# Altium schematic sheet P05_Ethernet.SchDoc
size A4
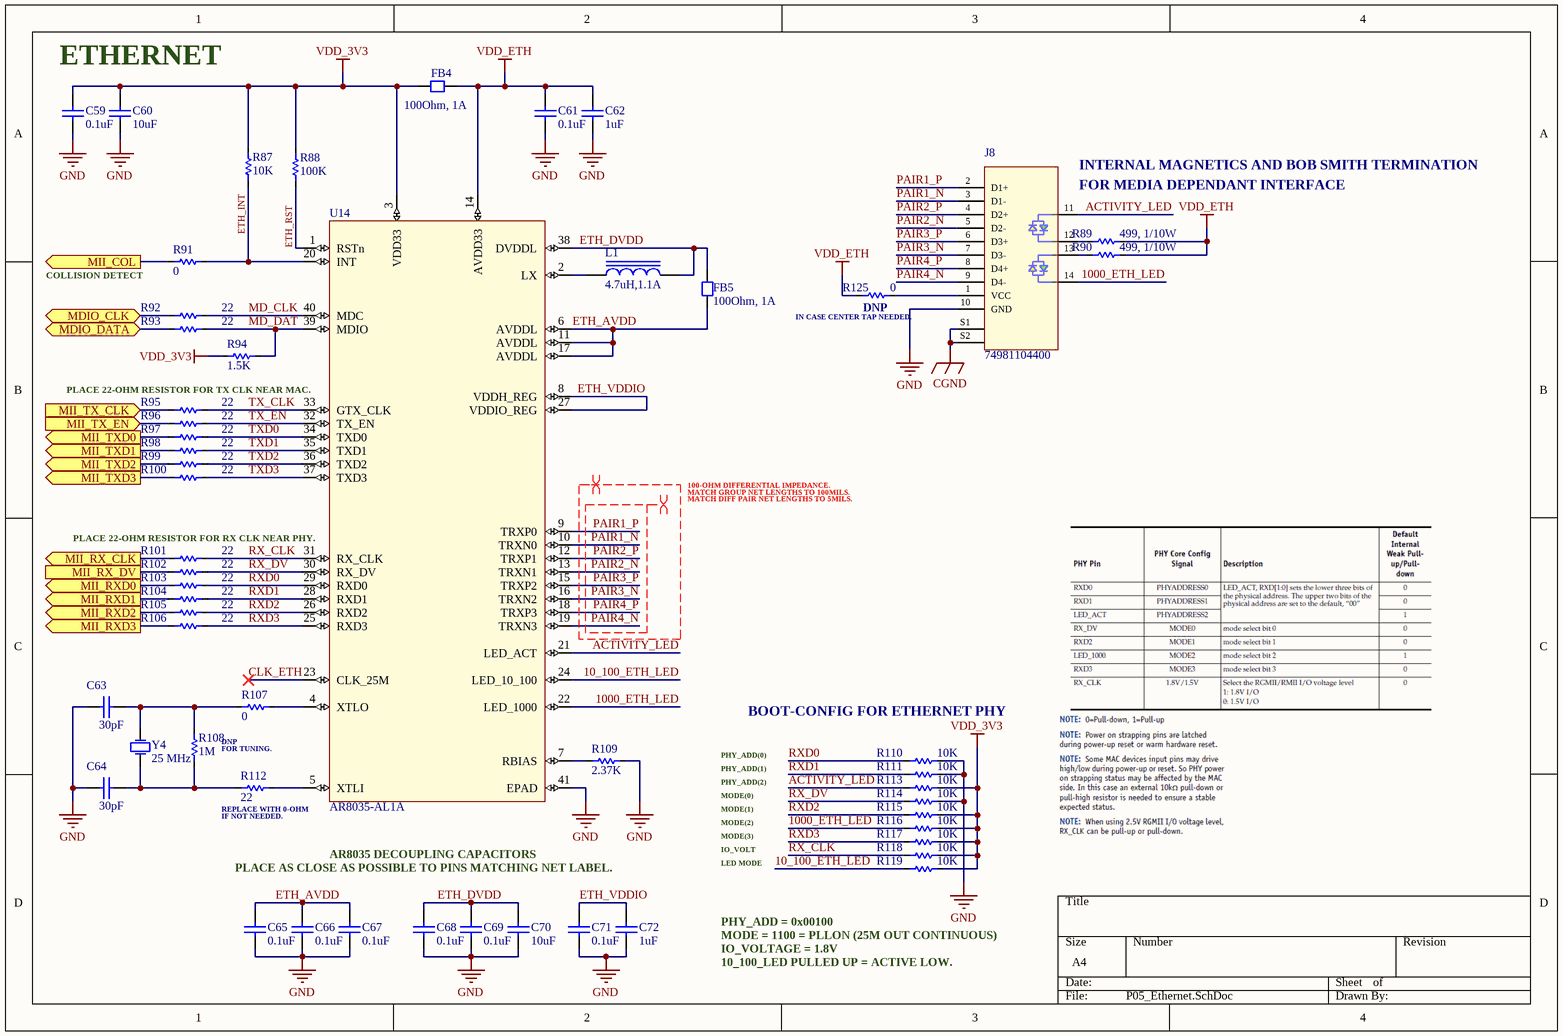
[diagram p0: P05_Ethernet.SchDoc]

## Parts
C59  0.1uF  [CAP_0603]
C60  10uF  [CAP_0603]
C61  0.1uF  [CAP_0603]
C62  1uF  [CAP_0603]
C63  30pF  [CAP_0603]
C64  30pF  [CAP_0603]
C65  0.1uF  [CAP_0603]
C66  0.1uF  [CAP_0603]
C67  0.1uF  [CAP_0603]
C68  0.1uF  [CAP_0603]
C69  0.1uF  [CAP_0603]
C70  10uF  [CAP_0603]
C71  0.1uF  [CAP_0603]
C72  1uF  [CAP_0603]
FB4  100Ohm, 1A  [CAP_0603]
FB5  100Ohm, 1A  [CAP_0603]
J8  74981104400  [74981104400]
L1  4.7uH,1.1A  [IND_1008]
R87  10K  [RES_0603]
R88  100K  [RES_0603]
R89  499, 1/10W  [RES_0603]
R90  499, 1/10W  [RES_0603]
R91  0  [RES_0603]
R92  22  [RES_0603]
R93  22  [RES_0603]
R94  1.5K  [RES_0603]
R95  22  [RES_0603]
R96  22  [RES_0603]
R97  22  [RES_0603]
R98  22  [RES_0603]
R99  22  [RES_0603]
R100  22  [RES_0603]
R101  22  [RES_0603]
R102  22  [RES_0603]
R103  22  [RES_0603]
R104  22  [RES_0603]
R105  22  [RES_0603]
R106  22  [RES_0603]
R107  0  [RES_0603]
R108  1M  [RES_0603]
R109  2.37K  [RES_0603]
R110  10K  [RES_0603]
R111  10K  [RES_0603]
R112  22  [RES_0603]
R113  10K  [RES_0603]
R114  10K  [RES_0603]
R115  10K  [RES_0603]
R116  10K  [RES_0603]
R117  10K  [RES_0603]
R118  10K  [RES_0603]
R119  10K  [RES_0603]
R125  0  [RES_0603]
U14  AR8035-AL1A  [QFN-40_5X5MM]
Y4  25 MHz  [7A-24MHz]

## Ports
MDIO_CLK (bidir), MDIO_DATA (bidir), MII_COL (out), MII_RX_CLK (out), MII_RX_DV, MII_RXD0 (out), MII_RXD1 (out), MII_RXD2 (out), MII_RXD3 (out), MII_TX_CLK (in), MII_TX_EN (in), MII_TXD0 (out), MII_TXD1 (out), MII_TXD2 (out), MII_TXD3 (out)

## Nets
CGND: J8.S1(Shield) J8.S2(Shield)
GND: C59.1 C60.1 C61.1 C62.1 C63.1(N) C64.1(N) C65.1 C66.1 C67.1 C68.1 C69.1 C70.1 C71.1 C72.1 J8.10(GND) R109.2 R110.2 R111.2 R114.2 U14.41(EPAD)
VDD_3V3: C59.2 C60.2 FB4.1 R87.2 R88.2 R94.2 R113.2 R115.2 R116.2 R117.2 R118.2 R119.2 U14.3(VDD33)
VDD_ETH: C61.2 C62.2 FB4.2 R89.2 R90.2 R125.1 U14.14(AVDD33)
10_100_ETH_LED: R119.1 U14.24(LED_10_100)
1000_ETH_LED: J8.14 R116.1 U14.22(LED_1000)
ACTIVITY_LED: J8.11 R113.1 U14.21(LED_ACT)
CLK_ETH: U14.23(CLK_25M)
ETH_AVDD: C65.2 C66.2 C67.2 FB5.1 U14.6(AVDDL) U14.11(AVDDL) U14.17(AVDDL)
ETH_DVDD: C68.2 C69.2 C70.2 FB5.2 L1.2 U14.38(DVDDL)
ETH_INT: R87.1 R91.2 U14.20(INT)
ETH_RST: R88.1 U14.1(RSTn)
ETH_VDDIO: C71.2 C72.2 U14.8(VDDH_REG) U14.27(VDDIO_REG)
MD_CLK: R92.2 U14.40(MDC)
MD_DAT: R93.2 R94.1 U14.39(MDIO)
MDIO_CLK: R92.1 ; port MDIO_CLK
MDIO_DATA: R93.1 ; port MDIO_DATA
MII_COL: R91.1 ; port MII_COL
MII_RX_CLK: R101.1 ; port MII_RX_CLK
MII_RX_DV: R102.1 ; port MII_RX_DV
MII_RXD0: R103.1 ; port MII_RXD0
MII_RXD1: R104.1 ; port MII_RXD1
MII_RXD2: R105.1 ; port MII_RXD2
MII_RXD3: R106.1 ; port MII_RXD3
MII_TX_CLK: R95.1 ; port MII_TX_CLK
MII_TX_EN: R96.1 ; port MII_TX_EN
MII_TXD0: R97.1 ; port MII_TXD0
MII_TXD1: R98.1 ; port MII_TXD1
MII_TXD2: R99.1 ; port MII_TXD2
MII_TXD3: R100.1 ; port MII_TXD3
PAIR1_N: J8.3(D1-) U14.10(TRXN0)
PAIR1_P: J8.2(D1+) U14.9(TRXP0)
PAIR2_N: J8.5(D2-) U14.13(TRXN1)
PAIR2_P: J8.4(D2+) U14.12(TRXP1)
PAIR3_N: J8.7(D3-) U14.16(TRXN2)
PAIR3_P: J8.6(D3+) U14.15(TRXP2)
PAIR4_N: J8.9(D4-) U14.19(TRXN3)
PAIR4_P: J8.8(D4+) U14.18(TRXP3)
RX_CLK: R101.2 R118.1 U14.31(RX_CLK)
RX_DV: R102.2 R114.1 U14.30(RX_DV)
RXD0: R103.2 R110.1 U14.29(RXD0)
RXD1: R104.2 R111.1 U14.28(RXD1)
RXD2: R105.2 R115.1 U14.26(RXD2)
RXD3: R106.2 R117.1 U14.25(RXD3)
TX_CLK: R95.2 U14.33(GTX_CLK)
TX_EN: R96.2 U14.32(TX_EN)
TXD0: R97.2 U14.34(TXD0)
TXD1: R98.2 U14.35(TXD1)
TXD2: R99.2 U14.36(TXD2)
TXD3: R100.2 U14.37(TXD3)
NetC63_2: C63.2(P) R107.1 R108.2 Y4.2(OSC2)
NetC64_2: C64.2(P) R108.1 R112.1 Y4.1(OSC1)
NetJ8_1: J8.1(VCC) R125.2
NetJ8_12: J8.12 R89.1
NetJ8_13: J8.13 R90.1
NetL1_1: L1.1 U14.2(LX)
NetR107_2: R107.2 U14.4(XTLO)
NetR109_1: R109.1 U14.7(RBIAS)
NetR112_2: R112.2 U14.5(XTLI)

## Layout directives
differential pair; differential pair class ETHERNET; rule Matched Net Lengths [Tolerance = 5mil]: PAIR1_N, PAIR1_P, PAIR2_N, PAIR2_P, PAIR3_N, PAIR3_P, PAIR4_N, PAIR4_P
differential pair; differential pair class Z100_DIFF_ETH; rule Matched Net Lengths [Tolerance = 100mil]: PAIR1_N, PAIR1_P, PAIR2_N, PAIR2_P, PAIR3_N, PAIR3_P, PAIR4_N, PAIR4_P

## Notes on the sheet
- ETHERNET
- (near J8) INTERNAL MAGNETICS AND BOB SMITH TERMINATION
- (near J8) FOR MEDIA DEPENDANT INTERFACE
- COLLISION DETECT
- (near R125) DNP
- (near R125) IN CASE CENTER TAP NEEDED.
- (near R95) PLACE 22-OHM RESISTOR FOR TX CLK NEAR MAC.
- 100-OHM DIFFERENTIAL IMPEDANCE.
- MATCH GROUP NET LENGTHS TO 100MILS.
- MATCH DIFF PAIR NET LENGTHS TO 5MILS.
- (near R101) PLACE 22-OHM RESISTOR FOR RX CLK NEAR PHY.
- BOOT-CONFIG FOR ETHERNET PHY
- DNP
- FOR TUNING.
- PHY_ADD(0)
- PHY_ADD(1)
- PHY_ADD(2)
- (near R112) REPLACE WITH 0-OHM
- (near R112) IF NOT NEEDED.
- MODE(0)
- MODE(1)
- MODE(2)
- MODE(3)
- IO_VOLT
- PLACE AS CLOSE AS POSSIBLE TO PINS MATCHING NET LABEL.
- AR8035 DECOUPLING CAPACITORS
- PHY_ADD = 0x00100
- LED MODE
- MODE = 1100 = PLLON (25M OUT CONTINUOUS)
- IO_VOLTAGE = 1.8V
- 10_100_LED PULLED UP = ACTIVE LOW.

## Library data of the parts
C59 C61 C65-C69 C71 = C0603C104M4RACTU: CAP CER 0.1UF 16V X7R 0603; Manufacturer: KEMET; Tolerance: 20%; ComponentLink1Description: Manufacturer; ComponentLink1URL: http://www.we-online.de; Value: 0.1uF; Rated Voltage: 16V; Ceramic Type: X7R; Supplier Part No.: 399-1099-1-ND; Package Reference: CAP_0603; Package Description: 0603; Mounting Technology: SMD; Manufacturer Part No.: C0603C104M4RACTU; Datasheet: https://content.kemet.com/datasheets/KEM_C1002_X7R_SMD.pdf; Supplier: Digi-Key; ComponentLink2Description: Datasheet; ComponentLink2URL: https://content.kemet.com/datasheets/KEM_C1002_X7R_SMD.pdf
C60 C70 = C0603C106M8PAC7867: CAP CER 10UF 10V X5R 0603; Manufacturer: KEMET; Ceramic Type: X7R; Tolerance: 20%; ComponentLink1Description: Manufacturer; ComponentLink1URL: http://www.we-online.de; Value: 10uF; Rated Voltage: 10V; Supplier Part No.: 399-14945-1-ND; Package Reference: CAP_0603; Package Description: 0603; Mounting Technology: SMD; Manufacturer Part No.: C0603C106M8PAC7867; Datasheet: https://content.kemet.com/datasheets/KEM_C1002_X7R_SMD.pdf; Supplier: Digi-Key; ComponentLink2Description: Datasheet; ComponentLink2URL: https://content.kemet.com/datasheets/KEM_C1002_X7R_SMD.pdf
C62 C72 = C0603C105M4RACTU: CAP CER 1UF 16V X7R 0603; Manufacturer: KEMET; Tolerance: 20%; ComponentLink1Description: Manufacturer; ComponentLink1URL: http://www.we-online.de; Value: 1uF; Rated Voltage: 16V; Ceramic Type: X7R; Supplier Part No.: 399-11136-1-ND; Package Reference: CAP_0603; Package Description: 0603; Mounting Technology: SMD; Manufacturer Part No.: C0603C105M4RACTU; Datasheet: https://content.kemet.com/datasheets/KEM_C1002_X7R_SMD.pdf; Supplier: Digi-Key; ComponentLink2Description: Datasheet; ComponentLink2URL: https://content.kemet.com/datasheets/KEM_C1002_X7R_SMD.pdf
C63 C64 = 06035A300JAT2A: CAP CER 30PF 50V C0G/NP0 0603; Manufacturer: AVX Corporation; Tolerance: 5%; Rated Voltage: 50 VDC; ComponentLink1Description: Manufacturer; ComponentLink1URL: http://www.we-online.de; ComponentLink2Description: Datasheet; ComponentLink2URL: https://katalog.we-online.com/pbs/datasheet/865080345012.pdf; Mounting Technology: SMD; Value: 30 pF; Manufacturer Part No.: 06035A300JAT2A; Datasheet: *; Supplier: Digi-Key; Package Reference: CAP_0603; Supplier Part No.: 478-7917-1-ND; Package Description: 0603
FB4 FB5 = MPZ1608D101BTA00: FERRITE BEAD 100 OHM 0603 1LN; Manufacturer: TDK Corporation; Datasheet: https://product.tdk.com/info/en/catalog/datasheets/beads_commercial_power_mpz1608_en.pdf; Manufacturer Part No.: MPZ1608D101BTA00; Supplier: Digi-Key; Package Description: 100 Ohms @ 100MHz 1 Power Line Ferrite Bead 0603 (1608 Metric) 1A 150mOhm; Supplier Part No.: 445-2988-1-ND; Package Reference: CAP_0603; Mounting Technology: SMD
J8 = 74981104400: WE-RJ45LAN INTEGRATED RJ45 TRANS; Manufacturer: Wurth Elektronik; ComponentLink1Description: Manufacturer; ComponentLink1URL: http://www.we-online.de; ComponentLink2Description: Datasheet; ComponentLink2URL: https://katalog.we-online.com/pbs/datasheet/74981104400.pdf; Manufacturer Part No.: 74981104400; Mounting Technology: SMD; Supplier: Digi-Key; Supplier Part No.: 732-13940-1-ND; Package Description: 1 Port RJ45 Magjack Connector Through Hole 10/100/1000 Base-T, AutoMDIX; Package Reference: 7498110440
L1 = CVH252009-4R7M: FIXED IND 4.7UH 1.1A 110MOHM SMD; Manufacturer: Bourns Inc.; Tolerance: 20%; Mounting Technology: SMD; Package Description: 1008; Manufacturer Part No.: CVH252009-4R7M; Supplier: Digi-Key; Supplier Part No.: CVH252009-4R7MDKR-ND; DCR: 110 mOhm; DC Current: 1.1A; Package Reference: IND_1008; ComponentLink1Description: Datasheet; ComponentLink1URL: https://www.bourns.com/docs/Product-Datasheets/CVH.pdf
R87 R110 R111 R113-R119 = RC0603FR-0710KL: RES SMD 10K OHM 1% 1/10W 0603; Manufacturer: Yageo; Tolerance: 1%; Manufacturer Part No.: RC0603FR-0710KL; Date: 2020; ComponentLink1Description: Manufacturer Link; ComponentLink1URL: http://www.vishay.com/company/brands/dale/; ComponentLink2Description: Datasheet; ComponentLink2URL: http://www.vishay.com/docs/20035/dcrcwe3.pdf; Supplier: Digikey; Supplier Part No.: 311-10.0KHRCT-ND; Datasheet: https://www.yageo.com/upload/media/product/productsearch/datasheet/rchip/PYu-RC_Group_51_RoHS_L_10.pdf; Package Reference: RES_0603; Package Description: 0603; Mounting Technology: SMD; Value: 10K; Power Rating: 1/10W
R88 = RC0603FR-07100KL: RES SMD 100K OHM 1% 1/10W 0603; Manufacturer: Yageo; Tolerance: 1%; Manufacturer Part No.: RC0603FR-07100KL; Date: 2020; ComponentLink1Description: Manufacturer Link; ComponentLink1URL: http://www.vishay.com/company/brands/dale/; ComponentLink2Description: Datasheet; ComponentLink2URL: http://www.vishay.com/docs/20035/dcrcwe3.pdf; Supplier: Digikey; Supplier Part No.: 311-100KHRCT-ND; Datasheet: https://www.yageo.com/upload/media/product/productsearch/datasheet/rchip/PYu-RC_Group_51_RoHS_L_10.pdf; Package Reference: RES_0603; Package Description: 0603; Mounting Technology: SMD; Value: 100K; Power Rating: 1/10W
R89 R90 = RC0603FR-07499RL: RES SMD 499 OHM 1% 1/10W 0603; Manufacturer: Yageo; Value: 499; Tolerance: 1%; Manufacturer Part No.: RC0603FR-07499RL; Date: 2020; ComponentLink1Description: Manufacturer Link; ComponentLink1URL: http://www.vishay.com/company/brands/dale/; ComponentLink2Description: Datasheet; ComponentLink2URL: http://www.vishay.com/docs/20035/dcrcwe3.pdf; Supplier: Digikey; Supplier Part No.: 311-499HRCT-ND; Datasheet: https://www.yageo.com/upload/media/product/productsearch/datasheet/rchip/PYu-RC_Group_51_RoHS_L_10.pdf; Package Reference: RES_0603; Package Description: 0603; Mounting Technology: SMD; Power Rating: 1/10W
R91 R107 R125 = RC0603JR-070RL: RES SMD 0 OHM JUMPER 1/10W 0603; Manufacturer: Yageo; Manufacturer Part No.: RC0603JR-070RL; Date: 2020; ComponentLink1Description: Manufacturer Link; ComponentLink1URL: http://www.vishay.com/company/brands/dale/; ComponentLink2Description: Datasheet; ComponentLink2URL: http://www.vishay.com/docs/20035/dcrcwe3.pdf; Supplier: Digikey; Supplier Part No.: 311-0.0GRCT-ND; Datasheet: https://www.yageo.com/upload/media/product/productsearch/datasheet/rchip/PYu-RC_Group_51_RoHS_L_10.pdf; Package Reference: RES_0603; Package Description: 0603; Mounting Technology: SMD; Value: 0; Power Rating: 1/10W
R92 R93 R95-R106 R112 = RC0603JR-0722RL: RES SMD 22 OHM 5% 1/10W 0603; Manufacturer: Yageo; Tolerance: 5%; Manufacturer Part No.: RC0603JR-0722RL; Date: 2020; ComponentLink1Description: Manufacturer Link; ComponentLink1URL: http://www.vishay.com/company/brands/dale/; ComponentLink2Description: Datasheet; ComponentLink2URL: http://www.vishay.com/docs/20035/dcrcwe3.pdf; Supplier: Digikey; Supplier Part No.: 311-22GRCT-ND; Datasheet: https://www.yageo.com/upload/media/product/productsearch/datasheet/rchip/PYu-RC_Group_51_RoHS_L_10.pdf; Package Reference: RES_0603; Package Description: 0603; Mounting Technology: SMD; Power Rating: 1/10W; Value: 22
R94 = RC0603FR-071K5L: RES SMD 1.5K OHM 1% 1/10W 0603; Manufacturer: Yageo; Tolerance: 1%; Manufacturer Part No.: RC0603FR-071K5L; Date: 2020; ComponentLink1Description: Manufacturer Link; ComponentLink1URL: http://www.vishay.com/company/brands/dale/; ComponentLink2Description: Datasheet; ComponentLink2URL: http://www.vishay.com/docs/20035/dcrcwe3.pdf; Supplier: Digikey; Supplier Part No.: 311-1.50KHRCT-ND; Datasheet: https://www.yageo.com/upload/media/product/productsearch/datasheet/rchip/PYu-RC_Group_51_RoHS_L_10.pdf; Package Reference: RES_0603; Package Description: 0603; Mounting Technology: SMD; Value: 1.5K; Power Rating: 1/10W
R108 = RC0603JR-071ML: RES SMD 1M OHM 5% 1/10W 0603; Manufacturer: Yageo; Tolerance: 5%; Manufacturer Part No.: RC0603JR-071ML; Date: 2020; ComponentLink1Description: Manufacturer Link; ComponentLink1URL: http://www.vishay.com/company/brands/dale/; ComponentLink2Description: Datasheet; ComponentLink2URL: http://www.vishay.com/docs/20035/dcrcwe3.pdf; Supplier: Digikey; Supplier Part No.: 311-1.0MGRCT-ND; Datasheet: https://www.yageo.com/upload/media/product/productsearch/datasheet/rchip/PYu-RC_Group_51_RoHS_L_10.pdf; Package Reference: RES_0603; Package Description: 0603; Mounting Technology: SMD; Value: 1M; Power Rating: 1/10W
R109 = RC0603FR-072K37L: RES SMD 2.37K OHM 1% 1/10W 0603; Manufacturer: Yageo; Tolerance: 1%; Manufacturer Part No.: RC0603FR-072K37L; Date: 2020; ComponentLink1Description: Manufacturer Link; ComponentLink1URL: http://www.vishay.com/company/brands/dale/; ComponentLink2Description: Datasheet; ComponentLink2URL: http://www.vishay.com/docs/20035/dcrcwe3.pdf; Supplier: Digikey; Supplier Part No.: 311-2.37KHRCT-ND; Datasheet: https://www.yageo.com/upload/media/product/productsearch/datasheet/rchip/PYu-RC_Group_51_RoHS_L_10.pdf; Package Reference: RES_0603; Package Description: 0603; Mounting Technology: SMD; Value: 2.37K; Power Rating: 1/10W
U14 = AR8035-AL1A: IC ETHERNET TRANSCEIVER FULL 1/1 GIGABIT 40QFN; Manufacturer: Qualcomm; Datasheet: *; Manufacturer Part No.: AR8035-AL1A; Supplier: Digi-Key; Package Reference: QFN-40_5x5MM; Supplier Part No.: AR8035-AL1A-ND; Package Description: 40-WFQFN Exposed Pad; Mounting Technology: SMD
Y4 = 7A-25.000MAAJ-T: CRYSTAL 25.0000MHZ 18PF SMD; Manufacturer: TXC CORPORATION; Date: 2020; ComponentLink1Description: Manufacturer Link; ComponentLink1URL: http://www.ecsxtal.com/; ComponentLink2Description: Data Sheet; Supplier Part No.: 887-1092-1-ND; Supplier: Digikey; Package Reference: 7A-24MHz; Package Description: 7A-24MHz; Mounting Technology: SMD; Manufacturer Part No.: 7A-25.000MAAJ-T; Datasheet: *; Value: 25 MHz